# Altium project Bee Hive Scale Board 3_1.PrjPcb
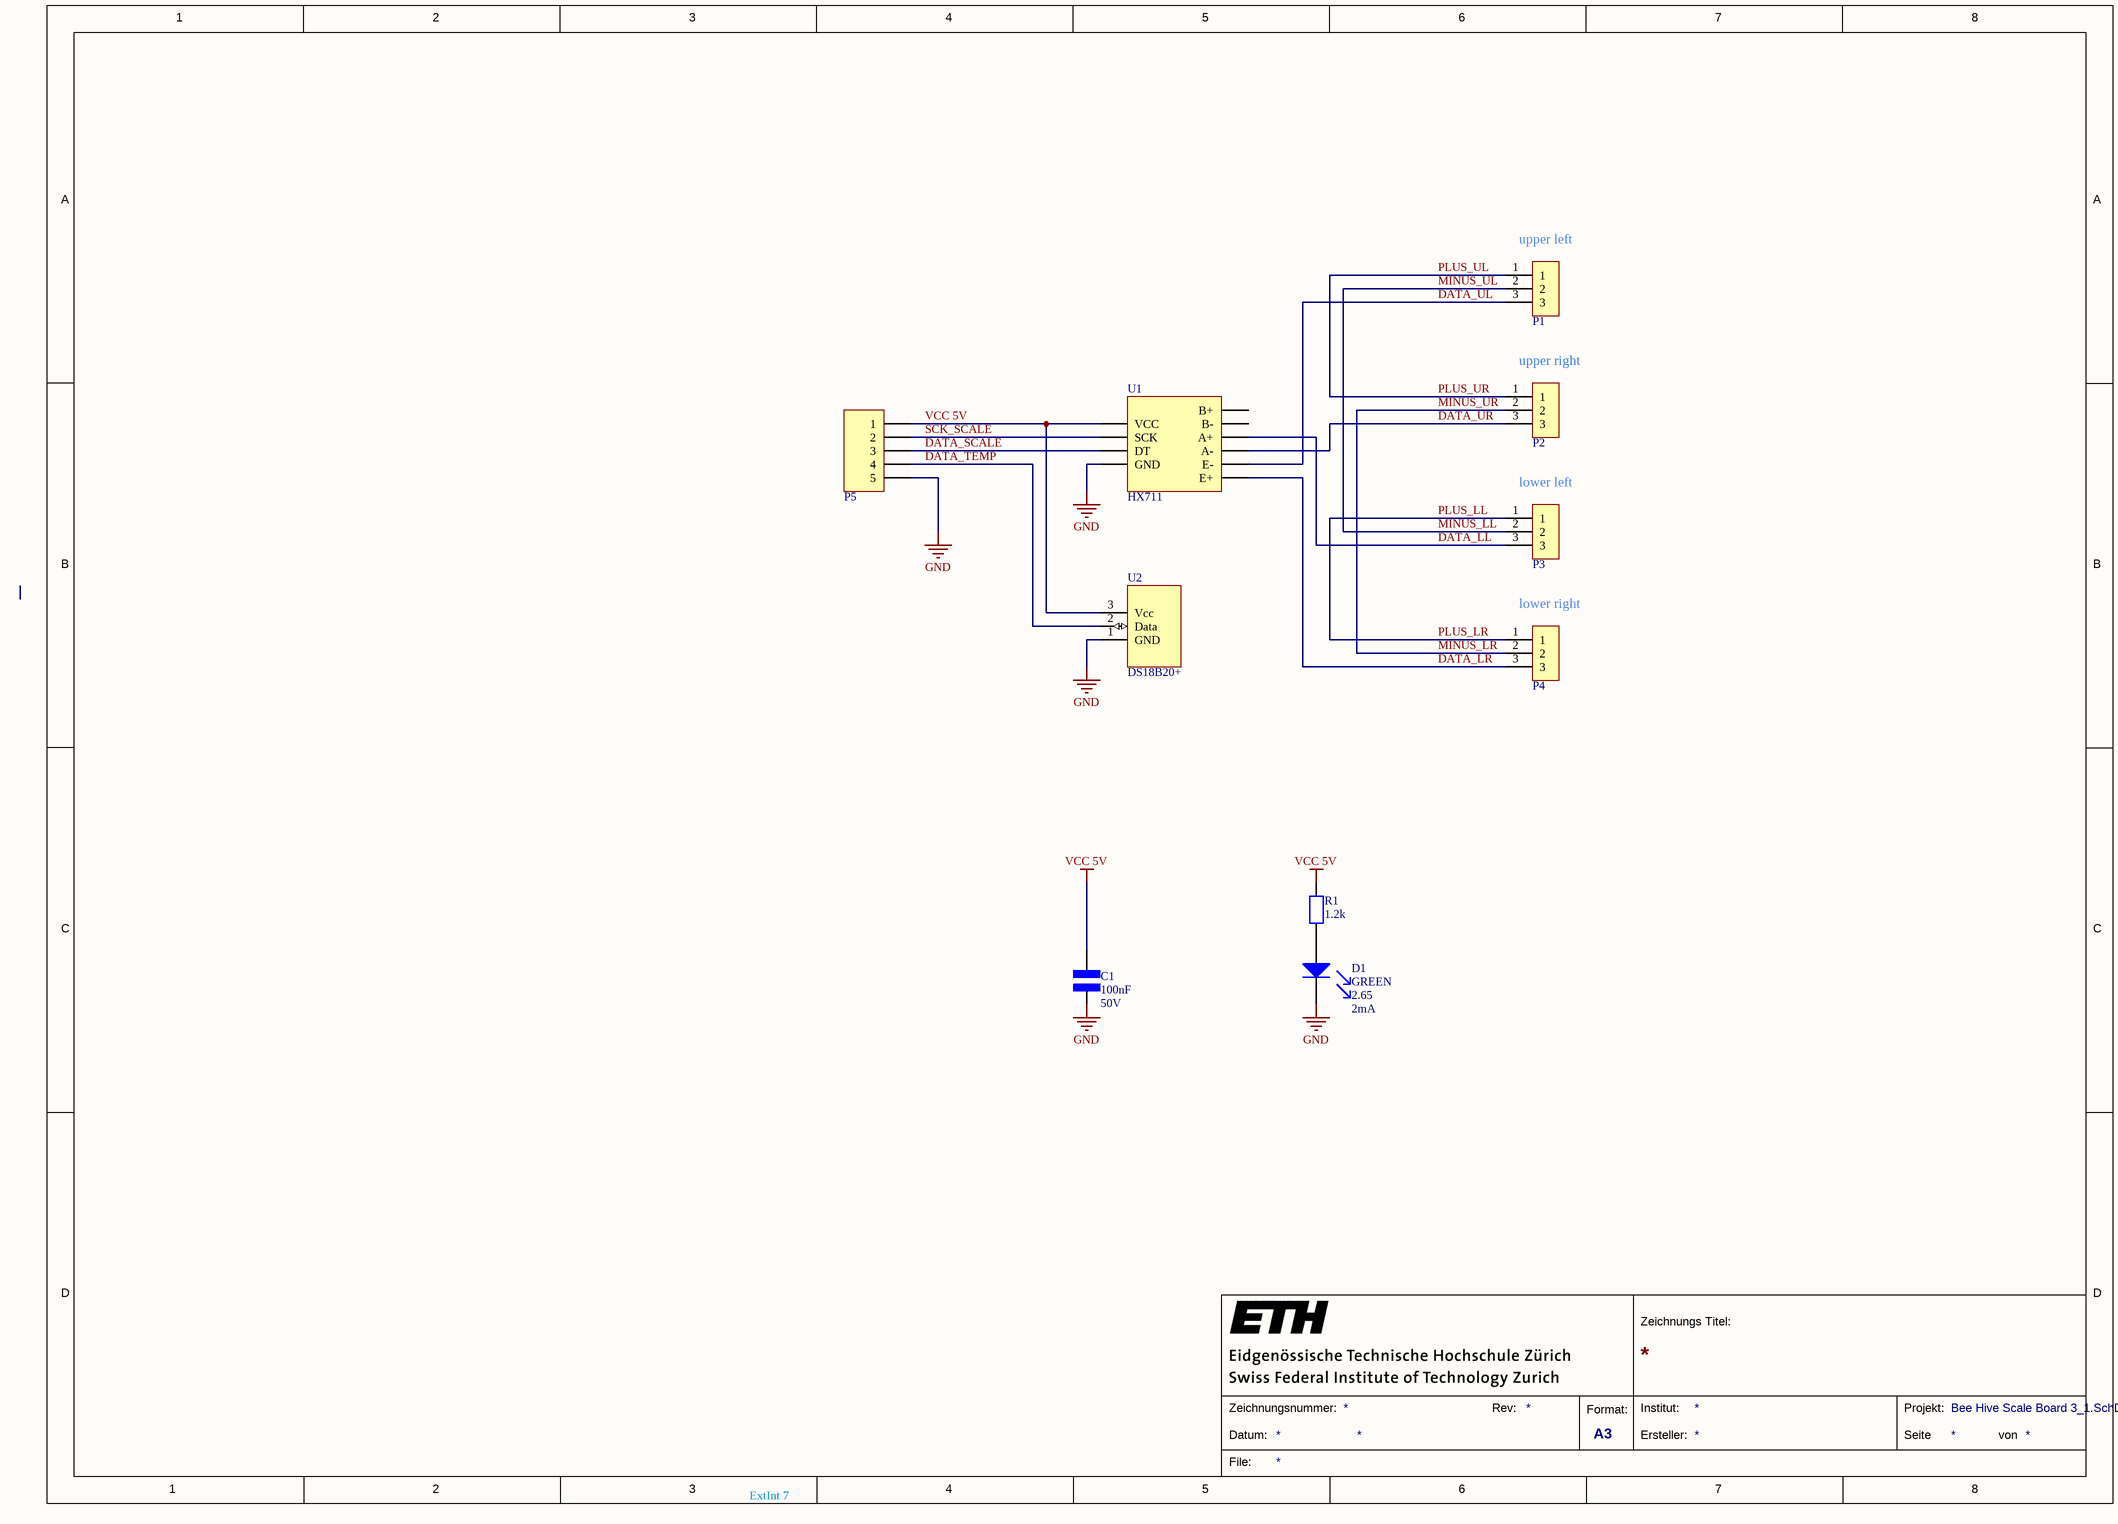
[diagram p0: Bee Hive Scale Board 3_1.SchDoc]
1 sheet, 10 parts. Net scope: global (net labels, ports and power ports of the same name join across sheets).
Board file: Bee Hive Scale Board 3_1.PcbDoc

## Sheet Bee Hive Scale Board 3_1.SchDoc
size A3

### Parts
C1  value 100nF  Umax: 50V  [CAP 0603]  (hidden comment: 100nF 0603_1)
D1  COLOR: GREEN  Forward Voltage: 2.65  If: 2mA  [LED SMD 0603 FOOTPRINT]  (hidden comment: LED Diode SMD LOW CURRENT)
P1  3-Pin Right Angle Housing  [3PIN - Connector right angle]  (value not drawn)
P2  3-Pin Right Angle Housing  [3PIN - Connector right angle]  (value not drawn)
P3  3-Pin Right Angle Housing  [3PIN - Connector right angle]  (value not drawn)
P4  3-Pin Right Angle Housing  [3PIN - Connector right angle]  (value not drawn)
P5  comment  [5PIN]  (value not drawn)
R1  value 1.2k  [RES 0603 FOOTPRINT]  (hidden comment: 1.2k Ohm 0603)
U1  HX711  [HX711 SCALE - long]
U2  DS18B20+  [DS1820 Footprint]

### Nets
GND: C1.1 D1.2(K) P5.5 U1.7(GND) U2.1(GND)
VCC 5V: C1.2 P5.1 R1.2 U1.10(VCC) U2.3(Vcc)
DATA_LL: P3.3 U1.4(A+)
DATA_LR: P4.3 U1.1(E+)
DATA_SCALE: P5.3 U1.8(DT)
DATA_TEMP: P5.4 U2.2(Data)
DATA_UL: P1.3 U1.2(E-)
DATA_UR: P2.3 U1.3(A-)
MINUS_LL: P1.2 P3.2  [also labelled MINUS_UL]
MINUS_LR: P2.2 P4.2  [also labelled MINUS_UR]
PLUS_LL: P3.1 P4.1  [also labelled PLUS_LR]
PLUS_UL: P1.1 P2.1  [also labelled PLUS_UR]
SCK_SCALE: P5.2 U1.9(SCK)
NetD1_1: D1.1(A) R1.1

Not connected (* = marked no-connect by the designer): U1 5(B-) 6(B+)

### Notes on the sheet
- (near P1) upper left
- (near P2) upper right
- (near P3) lower left
- (near P4) lower right
- ExtInt 7
- 1
- 2
- 3
- 4
- 5
- 6
- 7
- 8
- A
- B
- C
- D
- Zeichnungs Titel:
- Datum:
- Zeichnungsnummer:
- Rev:
- Format:
- A3
- Ersteller:
- Institut:
- Seite
- Projekt:
- von
- File:

### Library data of the parts
C1 = 100nF 0603_1: C CERAMIC SMD; Bezeichnung: C SMD; Hersteller: Yageo; Hersteller Nr: CC0603JPX7R9BB104; Haendler: Mouser; Haendler Nr: 603-CC0603JPX79BB104; Preis (CHF): 0.15; housing/footprint: 0603
D1 = LED Diode SMD - GREEN - 0603 - 2mA_1: APT1608LZGCK; Haendler: MOUSER; Haendler Nr: 604-APT1608LZGCK; Hersteller: Knightbright; Preis (CHF): 0.321; Link: http://ch.farnell.com/kingbright/kpt-1608lvzgck/led-gr-n-50mcd-525nm-smd/dp/2610409; Hersteller NR: APT1608LZGCK
P1-P4 = 3-Pin Right Angle: 3-Pin; Preis (CHF): 0.32; Haendler Nr: 538-22-28-8034; Haendler: Mouser; Hersteller: molex; ComponentLink1Description: Mouser; ComponentLink1URL: https://www.mouser.ch/ProductDetail/TE-Connectivity/640453-2?qs=sGAEpiMZZMs%252bGHln7q6pm5E1Eb6qwPl2KIU5TYv3tVY%3d; Hersteller Nr: 22-28-8034
P5 = 5-Pin: Haendler: MOUSER; Haendler Nr: 855-M20-9990546; Preis (CHF): 0.14; Hersteller: HARWIN; Hersteller Nr: M20-9990546
R1 = 1.2k Ohm 0603: R SMD; Hersteller Nr: RCS06031K20FKEA; Haendler: Mouser; Haendler Nr: 71-RCS06031K20FKEA; Preis (CHF): 0.01; Bezeichnung: R SMD; housing/footprint: 0603
U1 = HX711 XFW Alibaba Board: Preis (CHF): 1; Haendler: Alibaba; Haendler Nr: HX711 XFW
U2 = DS18B20: Temperature Sensor, 12 Bit, OneWire, 3-pin TO-92; Haendler: Mouser; Haendler Nr: 700-DS18B20+; Haendler 2: Distrelec; Haendler 2 Nr: 173-77-559